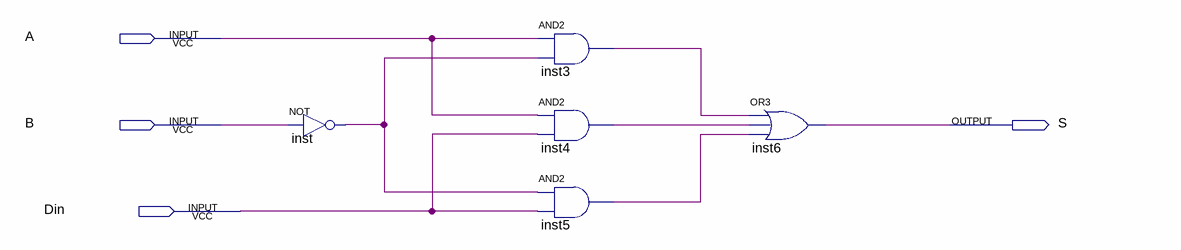
[diagram p0: schematic sheet]
// Quartus schematic InfSinal.bdf as structural Verilog: 5 symbols, 4 pins
module InfSinal (
  input  A,
  input  B,
  input  Din,
  output S
);

  wire inst3_out, inst4_out, inst5_out, inst_out;

  not inst (inst_out, B);
  and inst3 (inst3_out, A, inst_out);
  and inst4 (inst4_out, A, Din);
  and inst5 (inst5_out, inst_out, Din);
  or inst6 (S, inst3_out, inst4_out, inst5_out);
endmodule
